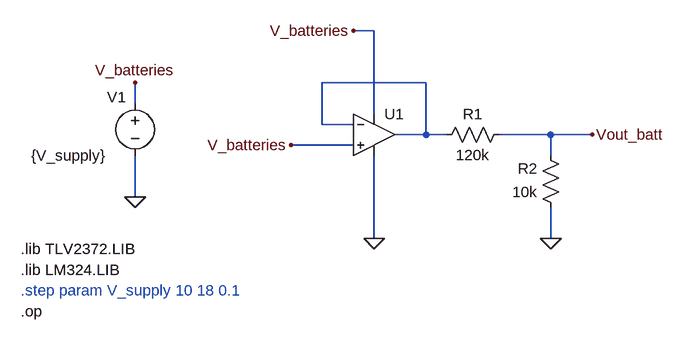
[diagram p0: schematic voltage_meaurementSINGLEbatteries.asc]
voltage_meaurementSINGLEbatteries.asc, the LTspice schematic file:
Version 4
SHEET 1 924 680
WIRE 320 -32 288 -32
WIRE 400 48 240 48
WIRE -48 80 -48 48
WIRE 320 96 320 -32
WIRE 240 112 240 48
WIRE 288 112 240 112
WIRE 400 128 400 48
WIRE 400 128 352 128
WIRE 432 128 400 128
WIRE 592 128 512 128
WIRE 656 128 592 128
WIRE 288 144 192 144
WIRE 592 160 592 128
WIRE -48 224 -48 160
WIRE 320 288 320 160
WIRE 592 288 592 240
FLAG 656 128 Vout_batt
FLAG 288 -32 V_batteries
FLAG 320 288 0
FLAG 192 144 V_batteries
FLAG -48 224 0
FLAG 592 288 0
FLAG -48 48 V_batteries
SYMBOL res 528 112 R90
WINDOW 0 0 56 VBottom 2
WINDOW 3 32 56 VTop 2
SYMATTR InstName R1
SYMATTR Value 120k
SYMATTR SpiceLine tol=1 pwr=0.6
SYMBOL res 608 256 R180
WINDOW 0 36 76 Left 2
WINDOW 3 36 40 Left 2
SYMATTR InstName R2
SYMATTR Value 10k
SYMATTR SpiceLine tol=1 pwr=0.6
SYMBOL OpAmps\\opamp2 320 64 R0
WINDOW 3 16 96 Invisible 2
SYMATTR InstName U1
SYMATTR Value2 LM324
SYMBOL voltage -48 64 R0
WINDOW 0 -14 6 Right 2
WINDOW 3 -160 96 Left 2
WINDOW 123 0 0 Left 0
WINDOW 39 0 0 Left 0
SYMATTR InstName V1
SYMATTR Value {V_supply}
TEXT -224 368 Left 2 ;.step param V_supply 10 18 0.1
TEXT -224 304 Left 2 !.lib TLV2372.LIB
TEXT -224 336 Left 2 !.lib LM324.LIB
TEXT -224 400 Left 2 !.op

The netlist it stands for:
* voltage_meaurementSINGLEbatteries.asc
R1 Vout_batt N001 120k tol=1 pwr=0.6
R2 0 Vout_batt 10k tol=1 pwr=0.6
XU1 V_batteries N001 V_batteries 0 N001 opamp2 LM324  ; pins In+ In- V+ V- OUT
V1 V_batteries 0 {V_supply}
* .step param V_supply 10 18 0.1
.lib TLV2372.LIB
.lib LM324.LIB
.op
.backanno
.end